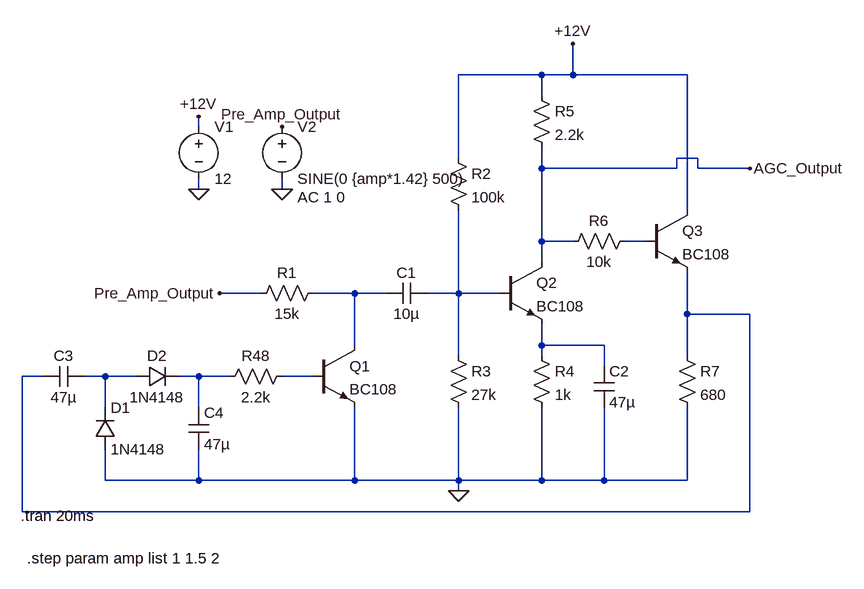
[diagram p0: schematic AGC.asc]
AGC.asc, the LTspice schematic file:
Version 4
SHEET 1 6596 3156
WIRE -2048 576 -2176 576
WIRE -2000 576 -2000 528
WIRE -2000 576 -2048 576
WIRE -1824 576 -2000 576
WIRE -2048 608 -2048 576
WIRE -2576 656 -2576 640
WIRE -2176 704 -2176 576
WIRE -1808 704 -1840 704
WIRE -2048 720 -2048 688
WIRE -1840 720 -1840 704
WIRE -1840 720 -2048 720
WIRE -1808 720 -1808 704
WIRE -1728 720 -1808 720
WIRE -2576 752 -2576 736
WIRE -2448 752 -2448 736
WIRE -1824 784 -1824 576
WIRE -2048 832 -2048 720
WIRE -2000 832 -2048 832
WIRE -1888 832 -1920 832
WIRE -2048 864 -2048 832
WIRE -2480 912 -2544 912
WIRE -2336 912 -2400 912
WIRE -2288 912 -2336 912
WIRE -2176 912 -2176 784
WIRE -2176 912 -2224 912
WIRE -2112 912 -2176 912
WIRE -1824 944 -1824 880
WIRE -1728 944 -1824 944
WIRE -2336 992 -2336 912
WIRE -2048 992 -2048 960
WIRE -1952 992 -2048 992
WIRE -2176 1008 -2176 912
WIRE -2048 1008 -2048 992
WIRE -1824 1008 -1824 944
WIRE -1952 1024 -1952 992
WIRE -2816 1040 -2848 1040
WIRE -2720 1040 -2752 1040
WIRE -2672 1040 -2720 1040
WIRE -2576 1040 -2608 1040
WIRE -2528 1040 -2576 1040
WIRE -2400 1040 -2448 1040
WIRE -2720 1088 -2720 1040
WIRE -2576 1088 -2576 1040
WIRE -2720 1200 -2720 1152
WIRE -2576 1200 -2576 1152
WIRE -2576 1200 -2720 1200
WIRE -2336 1200 -2336 1088
WIRE -2336 1200 -2576 1200
WIRE -2176 1200 -2176 1088
WIRE -2176 1200 -2336 1200
WIRE -2048 1200 -2048 1088
WIRE -2048 1200 -2176 1200
WIRE -1952 1200 -1952 1088
WIRE -1952 1200 -2048 1200
WIRE -1824 1200 -1824 1088
WIRE -1824 1200 -1952 1200
WIRE -2176 1216 -2176 1200
WIRE -2848 1248 -2848 1040
WIRE -1728 1248 -1728 944
WIRE -1728 1248 -2848 1248
FLAG -1728 720 AGC_Output
FLAG -2000 528 +12V
FLAG -2176 1216 0
FLAG -2576 752 0
FLAG -2576 640 +12V
FLAG -2544 912 Pre_Amp_Output
FLAG -2448 752 0
FLAG -2448 656 Pre_Amp_Output
SYMBOL npn -2400 992 R0
SYMATTR InstName Q1
SYMATTR Value BC108
SYMBOL npn -2112 864 R0
SYMATTR InstName Q2
SYMATTR Value BC108
SYMBOL cap -2224 896 R90
WINDOW 0 0 32 VBottom 2
WINDOW 3 32 32 VTop 2
SYMATTR InstName C1
SYMATTR Value 10µ
SYMBOL res -2384 896 R90
WINDOW 0 0 56 VBottom 2
WINDOW 3 32 56 VTop 2
SYMATTR InstName R1
SYMATTR Value 15k
SYMBOL res -2192 688 R0
SYMATTR InstName R2
SYMATTR Value 100k
SYMBOL res -2192 992 R0
SYMATTR InstName R3
SYMATTR Value 27k
SYMBOL res -2064 992 R0
SYMATTR InstName R4
SYMATTR Value 1k
SYMBOL cap -1968 1024 R0
SYMATTR InstName C2
SYMATTR Value 47µ
SYMBOL npn -1888 784 R0
SYMATTR InstName Q3
SYMATTR Value BC108
SYMBOL cap -2752 1024 R90
WINDOW 0 0 32 VBottom 2
WINDOW 3 32 32 VTop 2
SYMATTR InstName C3
SYMATTR Value 47µ
SYMBOL res -2064 592 R0
SYMATTR InstName R5
SYMATTR Value 2.2k
SYMBOL res -1904 816 R90
WINDOW 0 0 56 VBottom 2
WINDOW 3 32 56 VTop 2
SYMATTR InstName R6
SYMATTR Value 10k
SYMBOL res -1840 992 R0
SYMATTR InstName R7
SYMATTR Value 680
SYMBOL diode -2736 1152 M180
WINDOW 0 24 64 Left 2
WINDOW 3 24 0 Left 2
SYMATTR InstName D1
SYMATTR Value 1N4148
SYMBOL diode -2672 1024 M90
WINDOW 0 0 32 VBottom 2
WINDOW 3 32 32 VTop 2
SYMATTR InstName D2
SYMATTR Value 1N4148
SYMBOL cap -2592 1088 R0
SYMATTR InstName C4
SYMATTR Value 47µ
SYMBOL voltage -2576 640 R0
WINDOW 123 0 0 Left 0
WINDOW 39 0 0 Left 0
SYMATTR InstName V1
SYMATTR Value 12
SYMBOL res -2432 1024 R90
WINDOW 0 0 56 VBottom 2
WINDOW 3 32 56 VTop 2
SYMATTR InstName R48
SYMATTR Value 2.2k
SYMBOL voltage -2448 640 R0
WINDOW 123 24 124 Left 2
WINDOW 39 0 0 Left 0
SYMATTR InstName V2
SYMATTR Value SINE(0 {amp*1.42} 500)
SYMATTR Value2 AC 1 0
TEXT -2850 1254 Left 2 !.tran 20ms
TEXT -2840 1320 Left 2 !.step param amp list 1 1.5 2

The netlist it stands for:
* AGC.asc
Q1 N002 N008 0 0 BC108
Q2 AGC_Output N003 N005 0 BC108
C1 N003 N002 10µ
R1 N002 Pre_Amp_Output 15k
R2 +12V N003 100k
R3 N003 0 27k
R4 N005 0 1k
C2 N005 0 47µ
Q3 +12V N001 N004 0 BC108
C3 N006 N004 47µ
R5 +12V AGC_Output 2.2k
R6 N001 AGC_Output 10k
R7 N004 0 680
D1 0 N006 1N4148
D2 N006 N007 1N4148
C4 N007 0 47µ
V1 +12V 0 12
R48 N008 N007 2.2k
V2 Pre_Amp_Output 0 SINE(0 {amp*1.42} 500) AC 1 0
.model D D
.lib standard.dio
.model NPN NPN
.model PNP PNP
.lib standard.bjt
.tran 20ms
.step param amp list 1 1.5 2
.backanno
.end